# Altium schematic sheet CurrentSensor.SchDoc
size A4; DocumentNumber: 3; SheetNumber: 3; SheetTotal: 4
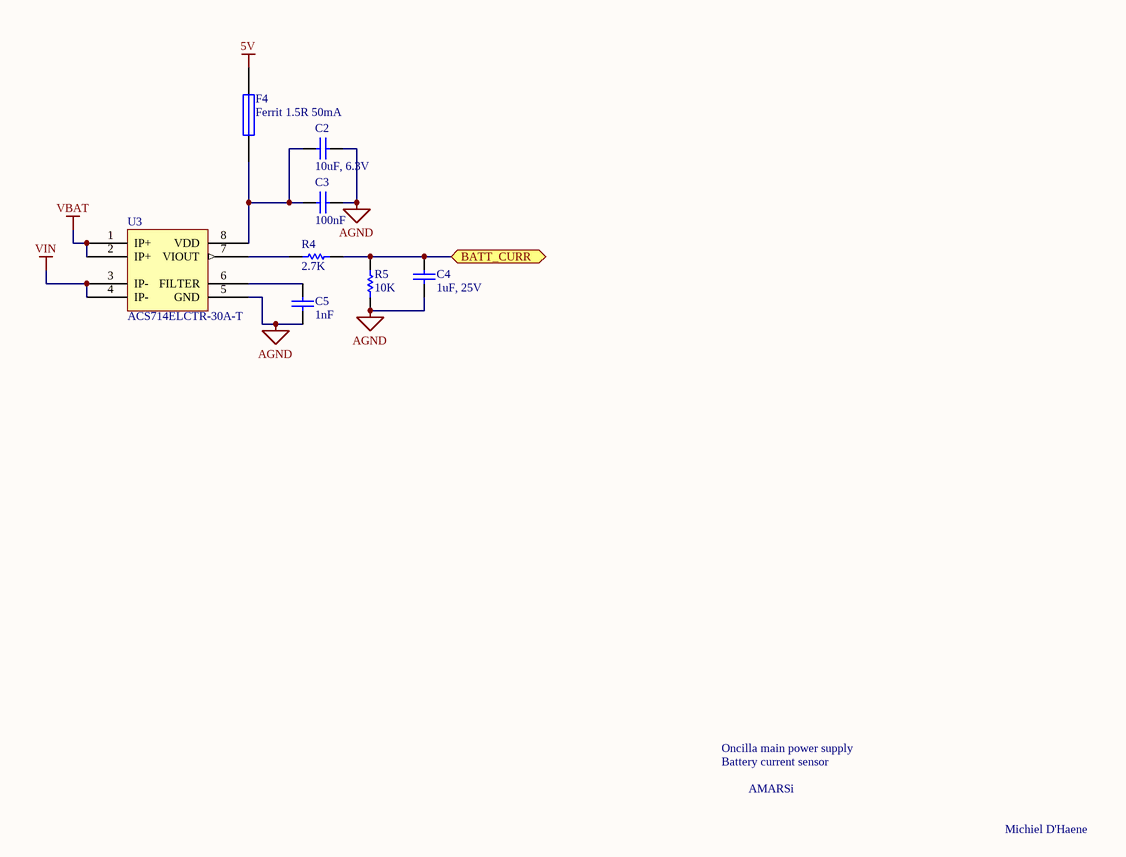
[diagram p0: CurrentSensor.SchDoc]

## Parts
C2  10uF, 6.3V  [CAPC1608L]
C3  100nF  [CAPC1608L]
C4  1uF, 25V  [CAPC1608L]
C5  1nF  [CAPC1608L]
F4  Ferrit 1.5R 50mA  [RESC1608L]
R4  2.7k  [RESC1608L]
R5  10k  [RESC1608L]
U3  ACS714ELCTR-30A-T  [SOIC-8_M]

## Ports
BATT_CURR

## Nets
5V: F4.2
AGND: C2.2 C3.2 C4.1 C5.1 R5.1 U3.5(GND)
VBAT: U3.1(IP+) U3.2(IP+)
VIN: U3.3(IP-) U3.4(IP-)
BATT_CURR: C4.2 R4.1 R5.2 ; port BATT_CURR
NetC2_1: C2.1 C3.1 F4.1 U3.8(VDD)
NetC5_2: C5.2 U3.6(FILTER)
NetR4_2: R4.2 U3.7(VIOUT)

## Notes on the sheet
- Oncilla main power supply
- Battery current sensor
- AMARSi
- Michiel D'Haene

## Library data of the parts
C2-C5 = Cap Semi: Capacitor (Semiconductor SIM Model); Published: 8-Jun-2000; LatestRevisionDate: 29-May-2009; LatestRevisionNote: IPC-7351 Footprint Added.; PackageReference: C1206; Publisher: Altium Limited; PackageDescription: Chip Capacitor
  C2: Value: 10uF, 6.3V
  C3: Value: 100nF
  C4: Value: 1uF, 25V
  C5: Value: 1nF
F4 = Fuse 1: Ferrit Bead; Published: 8-Jun-2000; LatestRevisionDate: 17-Jul-2002; LatestRevisionNote: Re-released for DXP Platform.; PackageReference: PIN-W2/E2.8; Publisher: Altium Limited
R4 R5 = Res Semi: Semiconductor Resistor; Published: 8-Jun-2000; LatestRevisionDate: 17-Jul-2002; LatestRevisionNote: Re-released for DXP Platform.; PackageReference: AXIAL-0.5; Publisher: Altium Limited
  R4: Value: 2.7K
  R5: Value: 10K
U3 = ACS714: Hall Effect-Based Linear Current Sensor